# Altium schematic sheet SheetTemplate.SchDoc
size A4
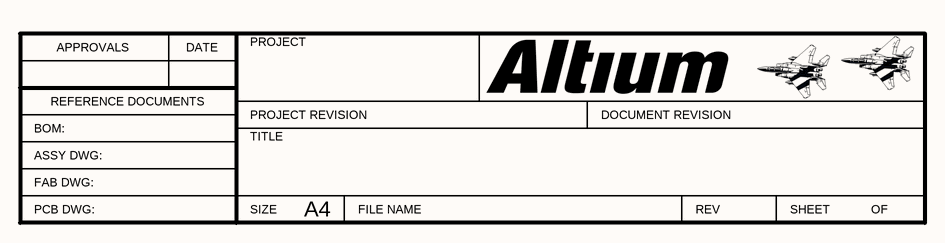
[diagram p0: SheetTemplate.SchDoc]

## Notes on the sheet
- APPROVALS
- DATE
- PROJECT
- BOM:
- REFERENCE DOCUMENTS
- TITLE
- PROJECT REVISION
- DOCUMENT REVISION
- ASSY DWG:
- FAB DWG:
- PCB DWG:
- SIZE
- A4
- FILE NAME
- REV
- SHEET
- OF